# Altium schematic sheet bqZUM_Scan_Shield.SchDoc: bqShield_CNC
size A4; Author: Pablo García; CompanyName: bq - Mundo Reader; Organization: bq - Mundo Reader; Revision: 0
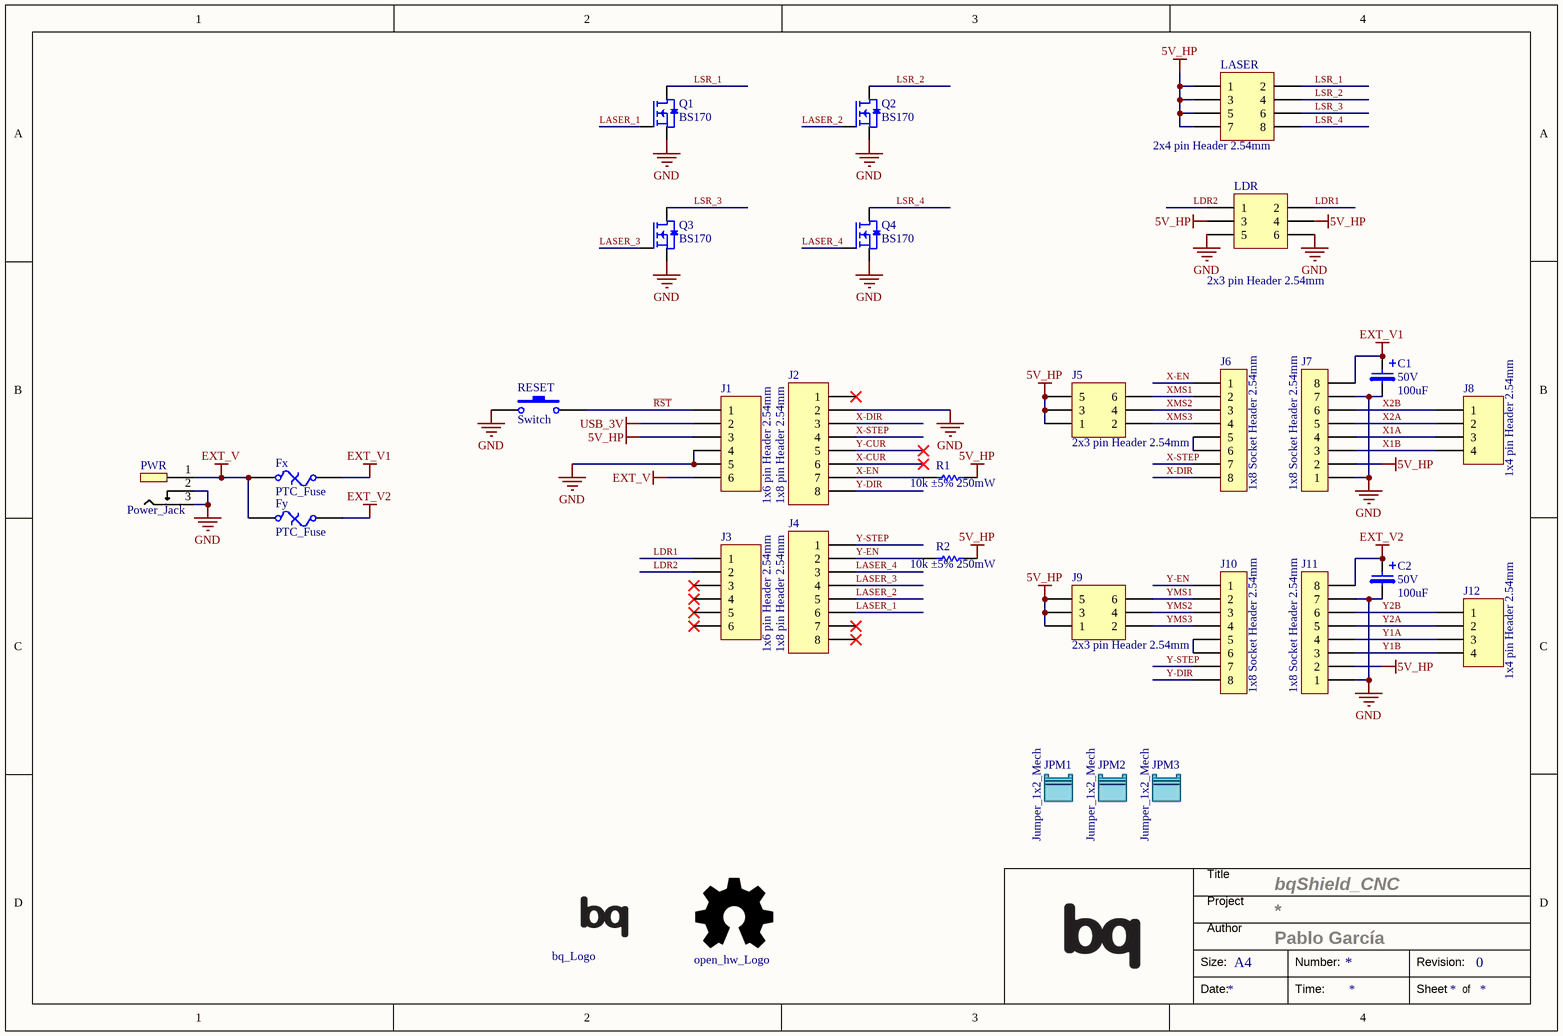
[diagram p0: bqZUM_Scan_Shield.SchDoc]

## Parts
C1  Voltage: 50V  Capacitance: 100uF  [Body_8-Height_11.5-Space_3,5_Folded]  (hidden comment: Electrolytic)
C2  Voltage: 50V  Capacitance: 100uF  [Body_8-Height_11.5-Space_3,5_Folded]  (hidden comment: Electrolytic)
Fx  PTC_Fuse  [MF-Rxx_S1_12.0]
Fy  PTC_Fuse  [MF-Rxx_S1_12.0]
J1  1x6 pin Header 2.54mm  [1x6 Pin Header 2.54]
J2  1x8 pin Header 2.54mm  [1x8 Pin Header 2.54]
J3  1x6 pin Header 2.54mm  [1x6 Pin Header 2.54]
J4  1x8 pin Header 2.54mm  [1x8 Pin Header 2.54]
J5  2x3 pin Header 2.54mm  [2x3 Pin Header 2.54]
J6  1x8 Socket Header 2.54mm  [1x8 Socket Header THT 2.54mm]
J7  1x8 Socket Header 2.54mm  [1x8 Socket Header THT 2.54mm]
J8  1x4 pin Header 2.54mm  [1x4 Pin Header 2.54]
J9  2x3 pin Header 2.54mm  [2x3 Pin Header 2.54]
J10  1x8 Socket Header 2.54mm  [1x8 Socket Header THT 2.54mm]
J11  1x8 Socket Header 2.54mm  [1x8 Socket Header THT 2.54mm]
J12  1x4 pin Header 2.54mm  [1x4 Pin Header 2.54]
JPM1  Jumper_1x2_Mech  (mechanical)
JPM2  Jumper_1x2_Mech  (mechanical)
JPM3  Jumper_1x2_Mech  (mechanical)
LASER  2x4 pin Header 2.54mm  [2x4 Pin Header 2.54]
LDR  2x3 pin Header 2.54mm  [2x3 Pin Header 2.54]
logo  bq_Logo  [bq_Logo_small]  (no BOM)
openhw  open_hw_Logo  [open_hw_Logo_small]  (no BOM)
PWR  Power_Jack  [Jack 2.1]
Q1  BS170  [TO-92-3L]
Q2  BS170  [TO-92-3L]
Q3  BS170  [TO-92-3L]
Q4  BS170  [TO-92-3L]
R1  value 10k ±5% 250mW  [Resistor_THT_6mm]  (hidden comment: Resistor)
R2  value 10k ±5% 250mW  [Resistor_THT_6mm]  (hidden comment: Resistor)
RESET  Switch  [SW_THT_6.0x6.0x5.0]

## Nets
5V_HP: J1.3 J5.1 J5.3 J5.5 J7.2 J9.1 J9.3 J9.5 J11.2 LASER.1 LASER.3 LASER.5 LASER.7 LDR.3 LDR.4 R1.2 R2.2
EXT_V: Fx.1 Fy.1 J1.6 PWR.1
EXT_V1: C1.1 Fx.2 J7.8
EXT_V2: C2.1 Fy.2 J11.8
GND: C1.2 C2.2 J1.4 J1.5 J2.2 J7.1 J7.7 J11.1 J11.7 LDR.5 LDR.6 PWR.2 PWR.3 Q1.1(S) Q2.1(S) Q3.1(S) Q4.1(S) RESET.1
USB_3V: J1.2
LASER_1: J4.6 Q1.2(G)
LASER_2: J4.5 Q2.2(G)
LASER_3: J4.4 Q3.2(G)
LASER_4: J4.3 Q4.2(G)
LDR1: J3.1 LDR.2
LDR2: J3.2 LDR.1
LSR_1: LASER.2 Q1.3(D)
LSR_2: LASER.4 Q2.3(D)
LSR_3: LASER.6 Q3.3(D)
LSR_4: LASER.8 Q4.3(D)
~{RST}: J1.1 RESET.2
X1A: J7.4 J8.3
X1B: J7.3 J8.4
X2A: J7.5 J8.2
X2B: J7.6 J8.1
X-CUR: J2.6
X-DIR: J2.3 J6.8
X-EN: J2.7 J6.1 R1.1
X-STEP: J2.4 J6.7
XMS1: J5.6 J6.2
XMS2: J5.4 J6.3
XMS3: J5.2 J6.4
Y1A: J11.4 J12.3
Y1B: J11.3 J12.4
Y2A: J11.5 J12.2
Y2B: J11.6 J12.1
Y-CUR: J2.5
Y-DIR: J2.8 J10.8
Y-EN: J4.2 J10.1 R2.1
Y-STEP: J4.1 J10.7
YMS1: J9.6 J10.2
YMS2: J9.4 J10.3
YMS3: J9.2 J10.4
NetJ6_5: J6.5 J6.6
NetJ10_5: J10.5 J10.6

Not connected (* = marked no-connect by the designer): J2 1*; J3 3* 4* 5* 6*; J4 7* 8*

## Notes on the sheet
- Title
- Project
- Size:
- Author
- A4
- Number:
- Revision:
- Date:
- Time:
- Sheet
- of

## Library data of the parts
C1 C2 = CAP_EL_100uF_50V: Capacitor Electrolytic; Manufacturer: Nichicon; Value: 100uF 50V; OrderingCode: UVR1H101MPD; Temp_ Max: 105; Temp_ Min: -40; Part Number: CAP_EL_100uF_50V; Price (€): 0,052
Fx Fy = FUSE 1.85A 30V: PTC Resettable Fuse; Manufacturer: Bourns; Voltage: 30V; Current: 1,85A; OrderingCode: MF-R185; Temp_ Max: 85; Temp_ Min: -40; Part Number: FUSE 1.85A 30V; Supplier: Abacus; Price (€): 0,26
J1 J3 = CON_PH_THT2.54_6: Manufacturer: Samtec; OrderingCode: TSW-106-07-T-S; Temp_ Max: 125; Temp_ Min: -40; Value: 6; OrderingCode 2: 613 006 111 21; Pitch: 2.54mm; Part Number: CON_PH_THT2.54_6; Supplier: Würth; Price (€): 0,26; Manufacturer 2: Würth Elektronik
J2 J4 = CON_PH_THT2.54_8: Manufacturer: Samtec; OrderingCode: TSW-108-07-T-S; Temp_ Max: 125; Temp_ Min: -40; Value: 8; OrderingCode 2: 613 008 111 21; Pitch: 2.54mm; Part Number: CON_PH_THT2.54_8; Supplier: Würth; Price (€): 0,35; Manufacturer 2: Würth Elektronik
J5 J9 = CON_DPH_THT2.54_6: 6 pin Dual Header 2.54mm; Manufacturer: Samtec; OrderingCode: TSW-103-07-T-D; Temp_ Max: 125; Temp_ Min: -40; Value: 6; OrderingCode 2: 613 006 211 21; Pitch: 2.54mm; Part Number: CON_DPH_THT2.54_6; Supplier: Würth; Manufacturer 2: Würth Elektronik; Price (€): 0,313
J6 J7 J10 J11 = CON_SH_THT2.54_8: 8 pin Socket Header 2.54mm; Manufacturer: Samtec; OrderingCode: SSW-108-01-T-S; Temp_ Max: 125; Temp_ Min: -40; OrderingCode 2: 613 008 118 21; Value: 8; Pitch: 2.54mm; Part Number: CON_SH_THT2.54_8; Supplier: Würth; Price (€): 0,438; Manufacturer 2: Würth Elektronik
J8 J12 = CON_PH_THT2.54_4: Manufacturer: Samtec; OrderingCode: TSW-104-07-T-S; Temp_ Max: 125; Temp_ Min: -40; Value: 4; OrderingCode 2: 613 004 111 21; Pitch: 2.54mm; Part Number: CON_PH_THT2.54_4; Supplier: Würth; Price (€): 0,211; Manufacturer 2: Würth Elektronik
JPM1-JPM3 = Jumper_2pin_Mech: 1x2 Jumper 2.54mm; Manufacturer: Würth; OrderingCode: 609 002 136 21; Temp_ Max: 125; Temp_ Min: -40; Value: Blue 1x2; Part Number: Jumper_2pin_Mech; Supplier: Würth
LASER = CON_DPH_THT2.54_8: 8 pin Dual Header 2.54mm; Manufacturer: Samtec; OrderingCode: TSW-104-07-T-D; Temp_ Max: 125; Temp_ Min: -40; OrderingCode 2: 613 008 211 21; Value: 8; Pitch: 2.54mm; Part Number: CON_DPH_THT2.54_8; Supplier: Würth; Price (€): 0,35; Manufacturer 2: Würth Elektronik
LDR = CON_DPH_THT2.54_6: 6 pin Dual Header 2.54mm; Manufacturer: Samtec; OrderingCode: TSW-103-07-T-D; Temp_ Max: 125; Temp_ Min: -40; OrderingCode 2: 613 006 211 21; Value: 6; Pitch: 2.54mm; Part Number: CON_DPH_THT2.54_6; Supplier: Würth; Price (€): 0,313; Manufacturer 2: Würth Elektronik
logo = bq Logo Small: Part Number: bq Logo Small
openhw = Open HW Logo Small: Part Number: Open HW Logo Small
PWR = DC Power Jack: Manufacturer: Switchcraft; Idc: 5A; OrderingCode: RAPC722X; OrderingCode 2: PJ-002A; Part Number: DC Power Jack; Price (€): 0,552; Manufacturer 2: CUI Inc
Q1-Q4 = BS170: Mosfet Channel N Enhancement Mode; Manufacturer: Fairchild Semiconductor; Vds: 60V; Vgss: 20V; Id: 0,5A; Temp_ Max: 150; Temp_ Min: -55; Part Number: BS170; OrderingCode: BS170; Price (€): 0,067
R1 R2 = R_10k_250mW_±5%: Manufacturer: KOA; Tolerance: ±5%; OrderingCode: CF1/4C103J; Power: 250mW; Resistance: 10k; Temp_ Max: 155; Temp_ Min: -55; OrderingCode 2: CFR-25JR-52-10K; PackageDescription: SMD; Part Number: R_10k_250mW_±5%; Price (€): 0,04; Manufacturer 2: Yageo
RESET = SW THT 6x6x5: Micro miniature pushbutton surface Switch; Manufacturer: Würth; OrderingCode: 430 186 050 716; Temp_ Max: 85; Temp_ Min: -40; Part Number: SW THT 6x6x5; Price (€): 0,058